# Altium schematic sheet LD_driver.SchDoc
size 420 x 297 mm; Address1: Address1; Address2: Address2; Address3: Address3; Address4: Address4; DocumentNumber: *Э3; SheetNumber: 5; SheetTotal: 11; DocumentType: Схема электрическая *
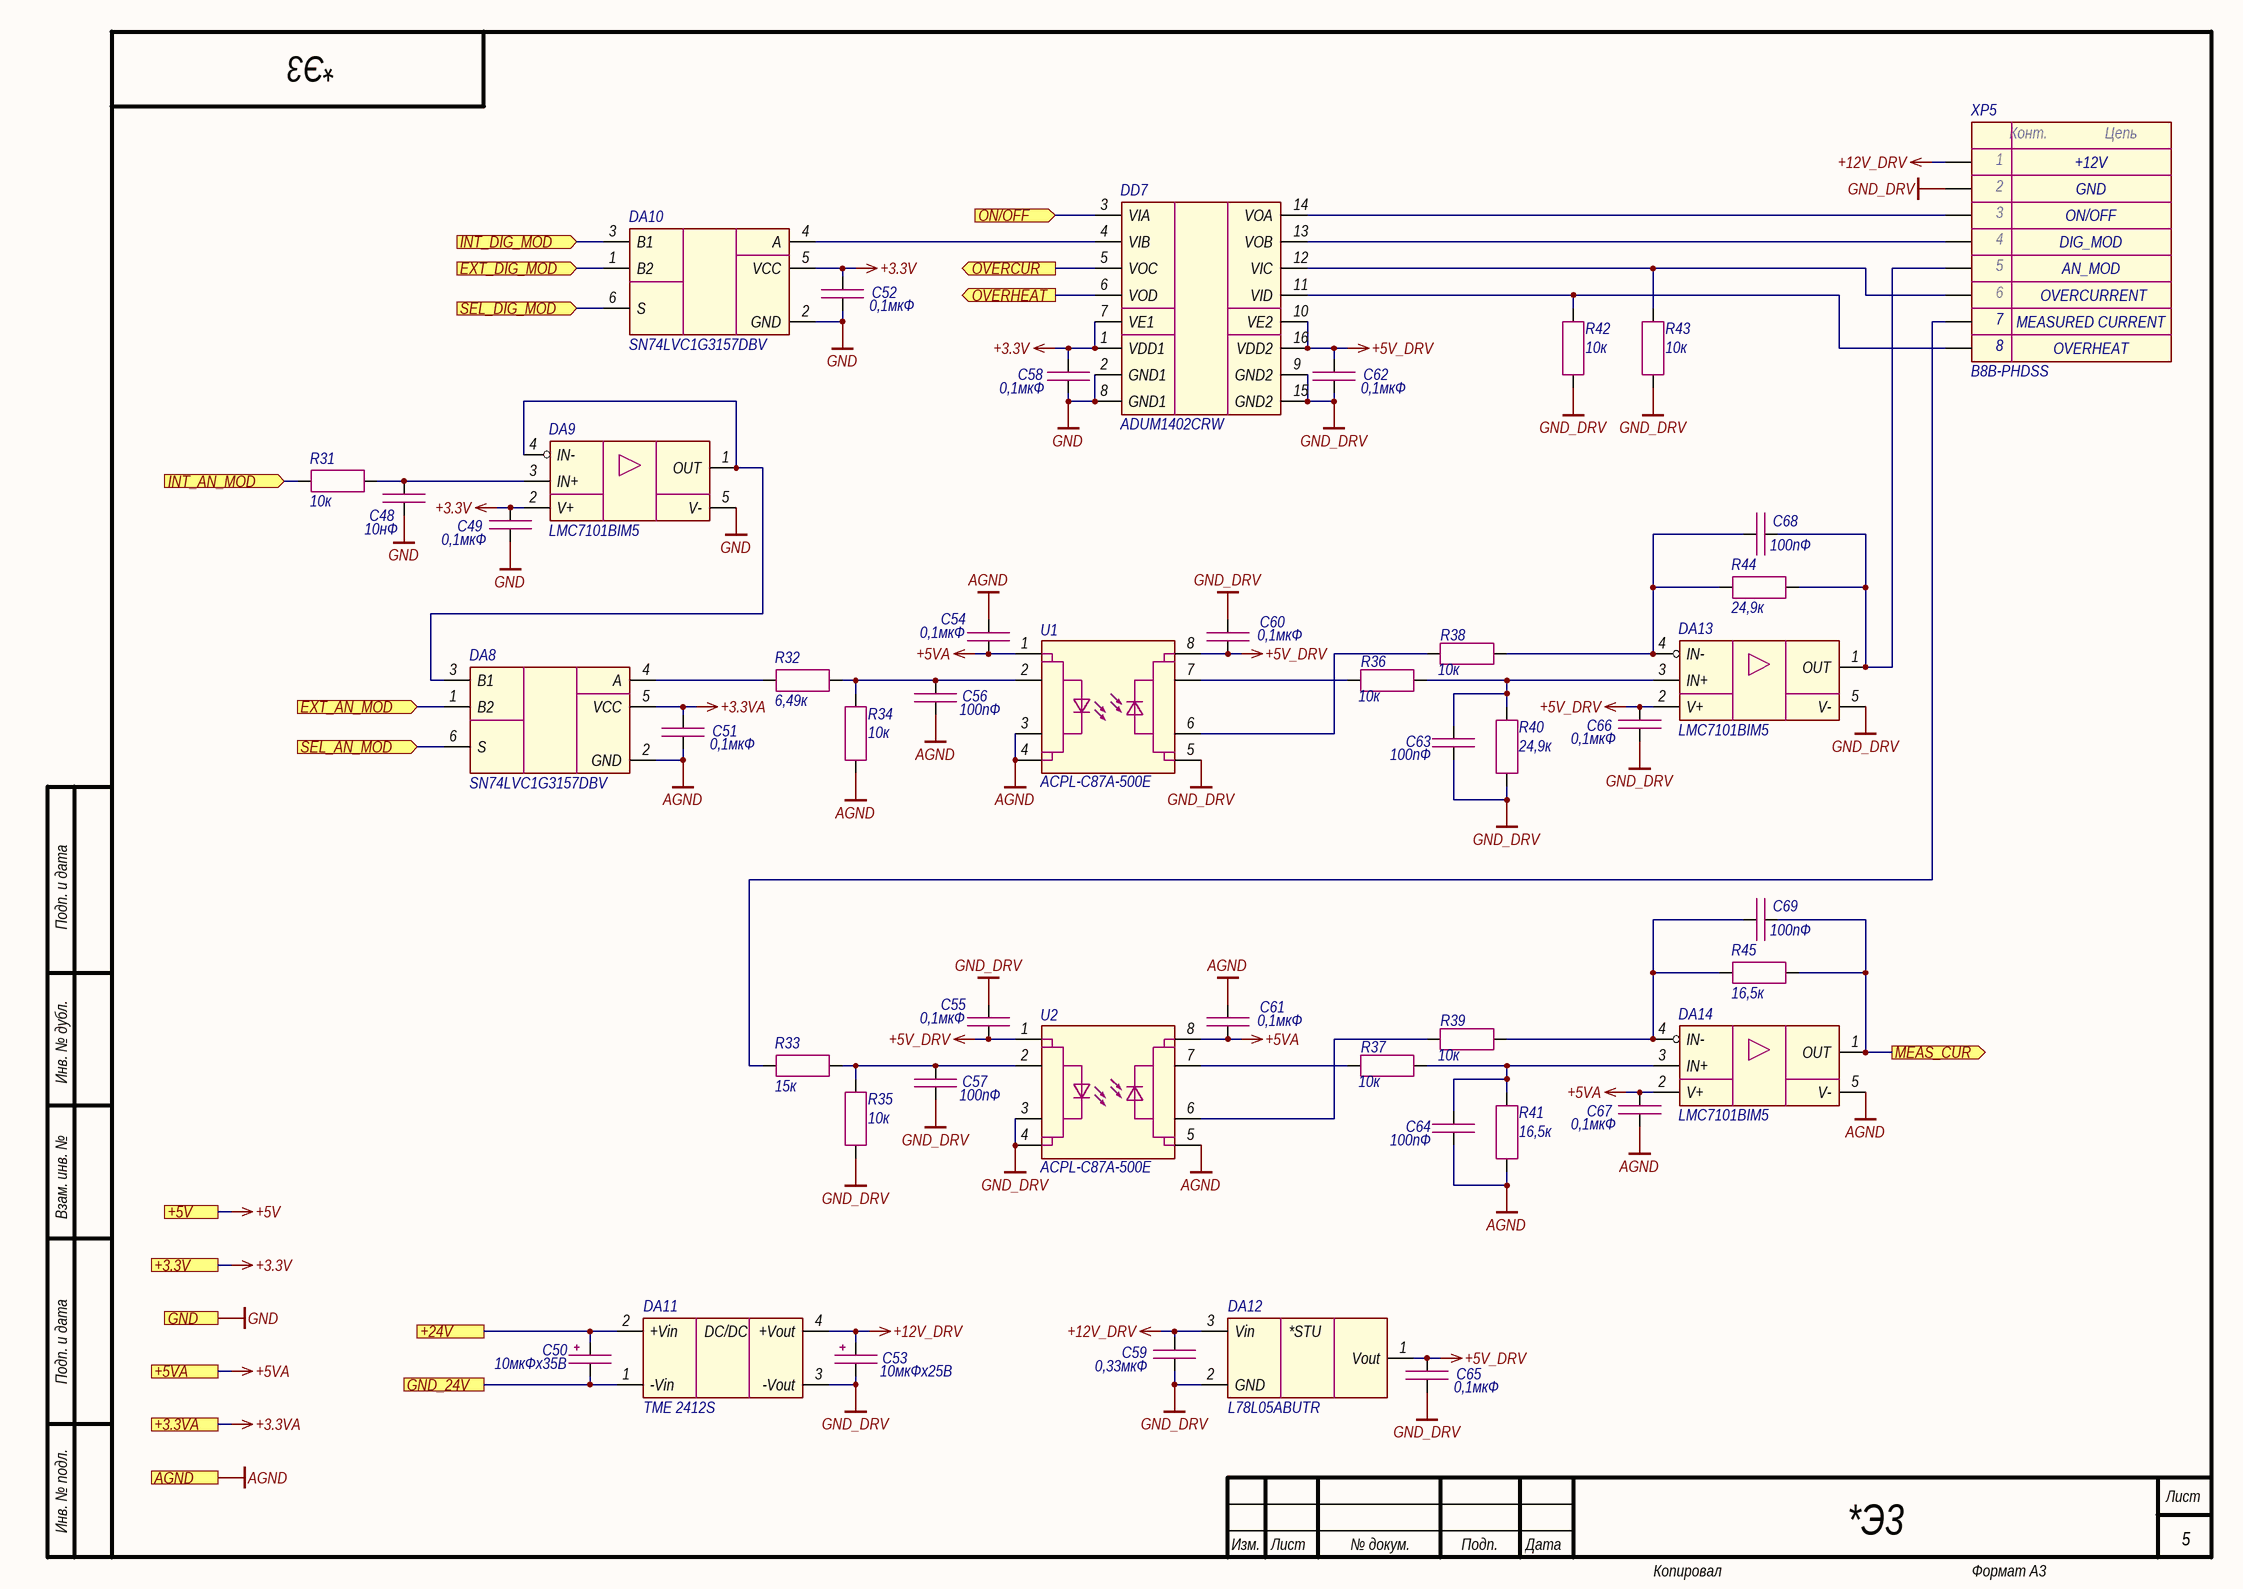
[diagram p0: LD_driver.SchDoc]

## Parts
C48  10нФ  [CAP_0603]
C49  0,1мкФ  [CAP_0603]
C50  10мкФх35B  [CAP_C]
C51  0,1мкФ  [CAP_0603]
C52  0,1мкФ  [CAP_0603]
C53  10мкФх25B  [CAP_C]
C54  0,1мкФ  [CAP_0603]
C55  0,1мкФ  [CAP_0603]
C56  100пФ  [CAP_0603]
C57  100пФ  [CAP_0603]
C58  0,1мкФ  [CAP_0603]
C59  0,33мкФ  [CAP_0805]
C60  0,1мкФ  [CAP_0603]
C61  0,1мкФ  [CAP_0603]
C62  0,1мкФ  [CAP_0603]
C63  100пФ  [CAP_0603]
C64  100пФ  [CAP_0603]
C65  0,1мкФ  [CAP_0603]
C66  0,1мкФ  [CAP_0603]
C67  0,1мкФ  [CAP_0603]
C68  100пФ  [CAP_0603]
C69  100пФ  [CAP_0603]
DA8  SN74LVC1G3157DBV  [SOT-23-6]
DA9  LMC7101BIM5  [SOT-23-5]
DA10  SN74LVC1G3157DBV  [SOT-23-6]
DA11  TME 2412S  [TME (SIP-4)]
DA12  L78L05ABUTR  [SOT-89]
DA13  LMC7101BIM5  [SOT-23-5]
DA14  LMC7101BIM5  [SOT-23-5]
DD7  ADUM1402CRW  [SOIC-16W]
R31  10к  [RES_0603]
R32  6,49к  [RES_0603]
R33  15к  [RES_0603]
R34  10к  [RES_0603]
R35  10к  [RES_0603]
R36  10к  [RES_0603]
R37  10к  [RES_0603]
R38  10к  [RES_0603]
R39  10к  [RES_0603]
R40  24,9к  [RES_0603]
R41  16,5к  [RES_0603]
R42  10к  [RES_0603]
R43  10к  [RES_0603]
R44  24,9к  [RES_0603]
R45  16,5к  [RES_0603]
U1  ACPL-C87A-500E  [SSO-8]
U2  ACPL-C87A-500E  [SSO-8]
XP5  B8B-PHDSS  [B8B-PHDSS]

## Ports
+3.3V (see Main[2C], Ethernet[3D], Fiber_interlock[2C], Flow_sensor[2C], Hardwiring[3D], Power_supply[1D]), +3.3VA (see Main[2C], Hardwiring[4D], Photodiode[1C], Thermistor[2C]), +5V (see Main[2C], Guide_laser[1C]), +5VA (see Main[2C], Photodiode[1C]), +24V (see Main[1C], Flow_sensor[2C], Hardwiring[3C], Indication[1C], Power_supply[1D]), AGND (see Main[2C], Hardwiring[4D], Photodiode[1C], Thermistor[2C]), EXT_AN_MOD (in, see Main[1C]), EXT_DIG_MOD (in, see Main[1B]), GND (see Main[2C], Ethernet[3D], Fiber_interlock[2C], Flow_sensor[2C], Guide_laser[1C], Hardwiring[3D], Indication[1C], Power_supply[1D]), GND_24V (see Main[1C], Flow_sensor[2C], Hardwiring[3C], Indication[1C], Power_supply[1D]), INT_AN_MOD (in, see Main[1C]), INT_DIG_MOD (in, see Main[1B]), MEAS_CUR (out, see Main[2B]), ON/OFF (in, see Main[1B]), OVERCUR (out, see Main[2B]), OVERHEAT (out, see Main[2B]), SEL_AN_MOD (in, see Main[1C]), SEL_DIG_MOD (in, see Main[1C])

## Nets
+3.3V: C49.1 C52.1 C58.1 DA9.2(V+) DA10.5(VCC) DD7.1(VDD1) DD7.7(VE1) ; port +3.3V
+3.3VA: C51.1 DA8.5(VCC) ; port +3.3VA
+5V: port +5V
+5V_DRV: C55.1 C60.1 C62.1 C65.1 C66.1 DA12.1(Vout) DA13.2(V+) DD7.10(VE2) DD7.16(VDD2) U1.8(VDD2) U2.1(VDD1)
+5VA: C54.1 C61.1 C67.1 DA14.2(V+) U1.1(VDD1) U2.8(VDD2) ; port +5VA
+12V_DRV: C53.1 C59.2 DA11.4(+Vout) DA12.3(Vin) XP5.1
AGND: C51.2 C54.2 C56.1 C61.2 C64.2 C67.2 DA8.2(GND) DA14.5(V-) R34.2 R41.2 U1.3(SHDN) U1.4(GND1) U2.5(GND2) ; port AGND
GND: C48.2 C49.2 C52.2 C58.2 DA9.5(V-) DA10.2(GND) DD7.2(GND1) DD7.8(GND1) ; port GND
GND_DRV: C53.2 C55.2 C57.1 C59.1 C60.2 C62.2 C63.2 C65.2 C66.2 DA11.3(-Vout) DA12.2(GND) DA13.5(V-) DD7.9(GND2) DD7.15(GND2) R35.2 R40.1 R42.2 R43.2 U1.5(GND2) U2.3(SHDN) U2.4(GND1) XP5.2
+24V: C50.1 DA11.2(+Vin) ; port +24V
EXT_AN_MOD: DA8.1(B2) ; port EXT_AN_MOD
EXT_DIG_MOD: DA10.1(B2) ; port EXT_DIG_MOD
GND_24V: C50.2 DA11.1(-Vin) ; port GND_24V
INT_AN_MOD: R31.1 ; port INT_AN_MOD
INT_DIG_MOD: DA10.3(B1) ; port INT_DIG_MOD
MEAS_CUR: C69.2 DA14.1(OUT) R45.1 ; port MEAS_CUR
ON/OFF: DD7.3(VIA) ; port ON/OFF
OVERCUR: DD7.5(VOC) ; port OVERCUR
OVERHEAT: DD7.6(VOD) ; port OVERHEAT
SEL_AN_MOD: DA8.6(S) ; port SEL_AN_MOD
SEL_DIG_MOD: DA10.6(S) ; port SEL_DIG_MOD
NetC48_1: C48.1 DA9.3(IN+) R31.2
NetC56_2: C56.2 R32.1 R34.1 U1.2(VIN)
NetC57_2: C57.2 R33.1 R35.1 U2.2(VIN)
NetC63_1: C63.1 DA13.3(IN+) R36.2 R40.2
NetC64_1: C64.1 DA14.3(IN+) R37.2 R41.1
NetC68_1: C68.1 DA13.4(IN-) R38.2 R44.1
NetC68_2: C68.2 DA13.1(OUT) R44.2 XP5.5
NetC69_1: C69.1 DA14.4(IN-) R39.2 R45.2
NetDA8_3: DA8.3(B1) DA9.1(OUT) DA9.4(IN-)
NetDA8_4: DA8.4(A) R32.2
NetDA10_4: DA10.4(A) DD7.4(VIB)
NetDD7_11: DD7.11(VID) R42.1 XP5.8
NetDD7_12: DD7.12(VIC) R43.1 XP5.6
NetDD7_13: DD7.13(VOB) XP5.4
NetDD7_14: DD7.14(VOA) XP5.3
NetR33_2: R33.2 XP5.7
NetR36_1: R36.1 U1.7(VOUT+)
NetR37_1: R37.1 U2.7(VOUT+)
NetR38_1: R38.1 U1.6(VOUT-)
NetR39_1: R39.1 U2.6(VOUT-)

## Notes on the sheet
- +12V
- GND
- ON/OFF
- DIG_MOD
- (near XP5) MEASURED CURRENT
- AN_MOD
- OVERCURRENT
- OVERHEAT
- Подп. и дата
- Инв. № дубл.
- Взам. инв. №
- Инв. № подл.
- Изм.
- Лист
- № докум.
- Подп.
- Дата
- Копировал
- Формат А3
- (in symbol Connector-8) Конт.; Цепь
- (in symbol LD2981ABU50TR) *STU
- (in symbol TME) DC/DC

## Library data of the parts
C48 = Capacitor: Manufacturer: Murata; Model: GRM188R71H103JA01D; Value: 10нФ; Document: *
C49 C51 C52 C54 C55 C58 C60-C62 C65-C67 = Capacitor: Manufacturer: Murata; Model: GRM188R71H104KA93D; Value: 0,1мкФ; Document: *
C50 = Capacitor_Polar: Model: TECAP, 10 мкФ, 35 В, тип C, 10%; Value: 10мкФх35B; Document: *; Manufacturer: *
C53 = Capacitor_Polar: Model: TECAP, 10 мкФ, 25 В, тип B, 10%; Value: 10мкФх25B; Document: *; Manufacturer: *
C56 C57 C63 C64 C68 C69 = Capacitor: Manufacturer: Murata; Model: GRM1885C1H101JA01D; Value: 100пФ; Document: *
C59 = Capacitor: Manufacturer: Murata; Model: GRM219R71H334KA88D; Value: 0,33мкФ; Document: *
DA8 DA10 = SN74LVC1G3157: Manufacturer: Texas Instruments; Model: SN74LVC1G3157DBV; Document: *
DA9 DA13 DA14 = LMC7101: Manufacturer: Texas Instruments; Model: LMC7101BIM5; Document: *
DA11 = TME: Manufacturer: Traco Power; Model: TME 2412S; Document: *
DA12 = LD2981ABU50TR: Manufacturer: STMicroelectronics; Model: L78L05ABUTR; Document: *
DD7 = ADUM1402: Manufacturer: Analog Devices; Model: ADUM1402CRW; Document: *
R31 R34-R39 R42 R43 = Resistor: Manufacturer: Yageo; Model: RC0603FR-0710KL; Value: 10к; Document: *
R32 = Resistor: Manufacturer: Yageo; Model: RC0603FR-076K49L; Value: 6,49к; Document: *
R33 = Resistor: Manufacturer: Yageo; Model: RC0603FR-0715KL; Value: 15к; Document: *
R40 R44 = Resistor: Manufacturer: Yageo; Model: RC0603FR-0724K9L; Value: 24,9к; Document: *
R41 R45 = Resistor: Manufacturer: Yageo; Model: RC0603FR-0716K5L; Value: 16,5к; Document: *
U1 U2 = ACPL-C87: Manufacturer: Broadcom; Model: ACPL-C87A-500E
XP5 = Connector-8: Manufacturer: JST; Model: B8B-PHDSS; Document: *